# Altium project NRF_Layout_ver2.PrjPcb
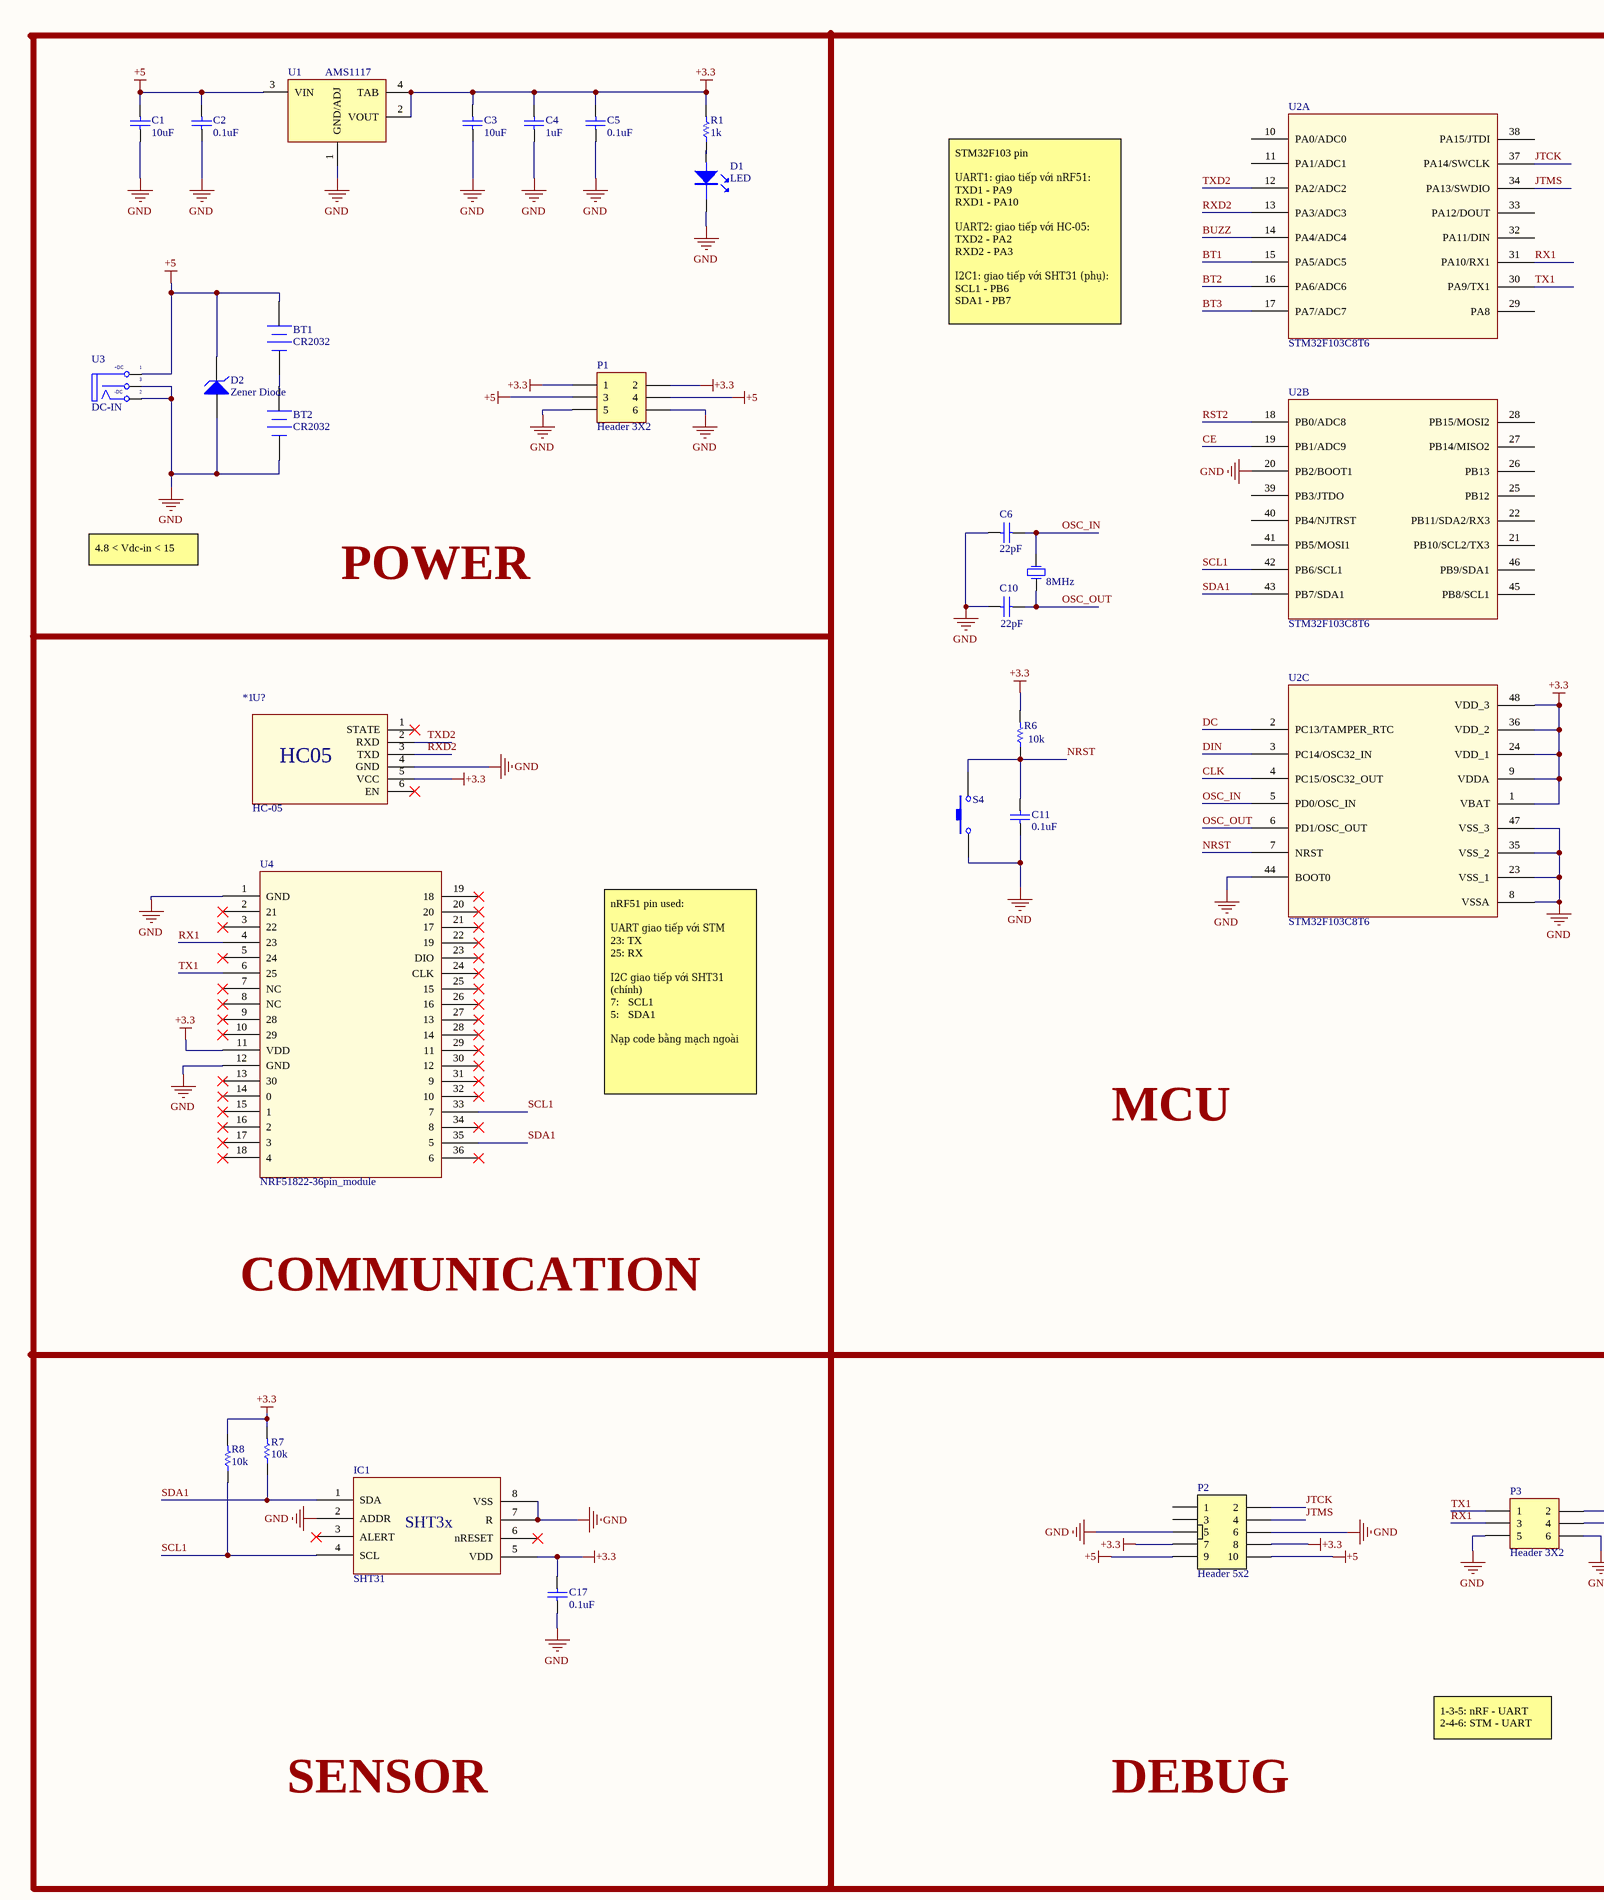
[diagram p0: Sheet1.SchDoc, left]
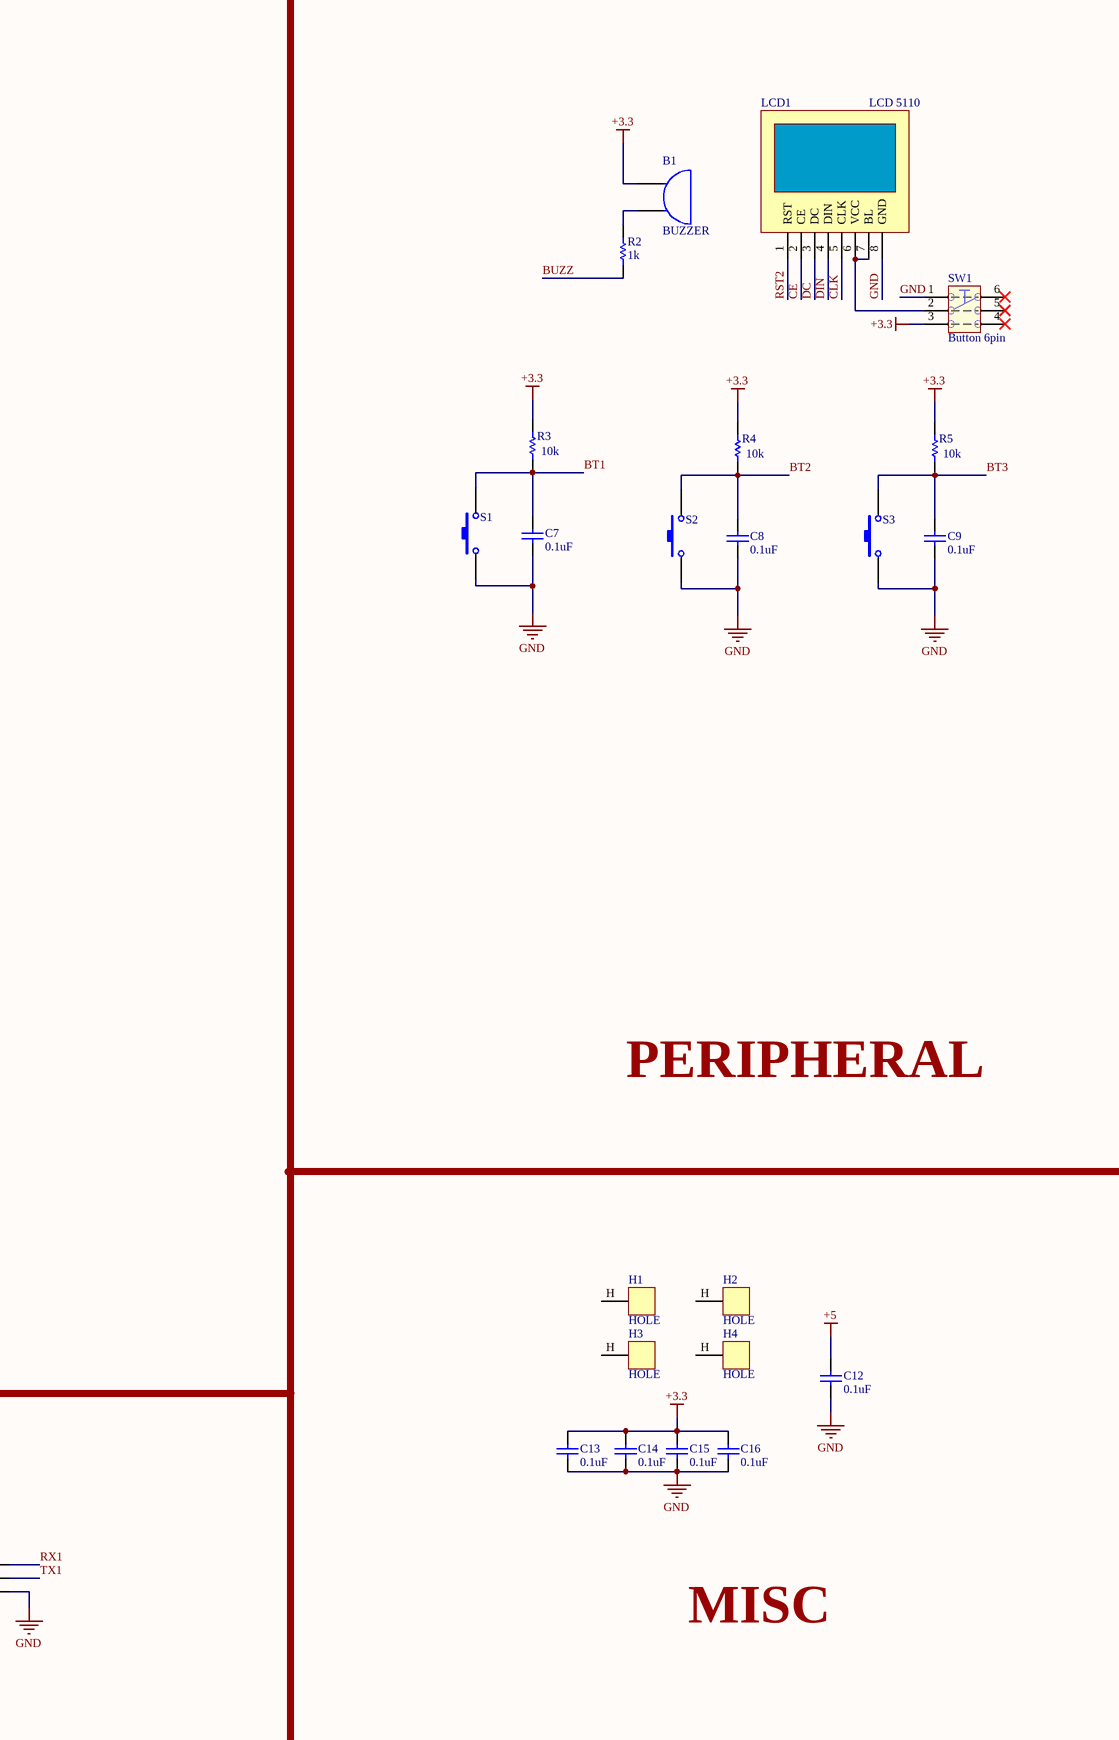
[diagram p1: Sheet1.SchDoc, right]
1 sheet, 50 parts. Net scope: global (net labels, ports and power ports of the same name join across sheets).
Board file: PCB1.PcbDoc

## Sheet Sheet1.SchDoc
size A2

### Parts
*1  HC-05  [HC-05]
B1  BUZZER  [SPEAKER]
BT1  CR2032  [PIN3V]
BT2  CR2032  [PIN3V]
C1  10uF  [C0805]
C2  0.1uF  [C0805]
C3  10uF  [C0805]
C4  1uF  [C0805]
C5  0.1uF  [C0805]
C6  22pF  [C0805]
C7  0.1uF  [C0805]
C8  0.1uF  [C0805]
C9  0.1uF  [C0805]
C10  22pF  [C0805]
C11  0.1uF  [C0805]
C12  0.1uF  [C0805]
C13  0.1uF  [C0805]
C14  0.1uF  [C0805]
C15  0.1uF  [C0805]
C16  0.1uF  [C0805]
C17  0.1uF  [C0805]
D1  LED  [LED SMD 0805]
D2  Zener Diode  [Zener Diode]
H1  HOLE  [HOLE]
H2  HOLE  [HOLE]
H3  HOLE  [HOLE]
H4  HOLE  [HOLE]
IC1  SHT31  [DFN-8]
LCD1  LCD 5110  [LCD 5110]
P1  Header 3X2  [HDR2X3]
P2  Header 5x2  [Header 5x2 horizontal (2.54mm)]
P3  Header 3X2  [HDR2X3]
R1  1k  [R0805]
R2  1k  [R0805]
R3  10k  [R0805]
R4  10k  [R0805]
R5  10k  [R0805]
R6  10k  [R0805]
R7  10k  [R0805]
R8  10k  [R0805]
S1  SWITCH  [SW 4PIN]  (value not drawn)
S2  SWITCH  [SW 4PIN]  (value not drawn)
S3  SWITCH  [SW 4PIN]  (value not drawn)
S4  SWITCH  [SW 4PIN]  (value not drawn)
SW1  Button 6pin  [BT 6pin]
U1  AMS1117  [SOT223 - 3 LEAD]
U2  STM32F103C8T6  [LQFP48_7x7]  (parts A,B,C of 3)
U3  DC-IN  [DC-IN]
U4  NRF51822-36pin_module  [NRF51822_Module]
Y1  8MHz  [XTAL_HC-49/U]

### Nets
+3.3: *1.5(VCC) B1.1(A) C3.2 C4.1 C5.2 C13.2 C14.2 C15.2 C16.2 C17.2 IC1.5(VDD) P1.1 P1.2 P2.7 P2.8 R1.1 R3.1 R4.1 R5.1 R6.1 R7.1 R8.1 SW1.3 U1.2(VOUT) U1.4(TAB) U2.1(VBAT) U2.9(VDDA) U2.24(VDD_1) U2.36(VDD_2) U2.48(VDD_3) U4.11(VDD)
+5: BT1.1(+) C1.2 C2.2 C12.2 D2.2(K) P1.3 P1.4 P2.9 P2.10 U1.3(VIN) U3.1(T)
GND: *1.4(GND) BT2.2(-) C1.1 C2.1 C3.1 C4.2 C5.1 C6.1 C7.1 C8.1 C9.1 C10.1 C11.1 C12.1 C13.1 C14.1 C15.1 C16.1 C17.1 D1.2 D2.1(A) IC1.2(ADDR) IC1.7(R) IC1.8(VSS) LCD1.8(GND) P1.5 P1.6 P2.5 P2.6 P3.5 P3.6 S1.1 S2.1 S3.1 S4.1 SW1.1 U1.1(GND/ADJ) U2.8(VSSA) U2.20(PB2/BOOT1) U2.23(VSS_1) U2.35(VSS_2) U2.44(BOOT0) U2.47(VSS_3) U3.2(TN) U3.3(S) U4.1(GND) U4.12(GND)
BT1: C7.2 R3.2 S1.2 U2.15(PA5/ADC5)
BT2: C8.2 R4.2 S2.2 U2.16(PA6/ADC6)
BT3: C9.2 R5.2 S3.2 U2.17(PA7/ADC7)
BUZZ: R2.2 U2.14(PA4/ADC4)
CE: LCD1.2(CE) U2.19(PB1/ADC9)
CLK: LCD1.5(CLK) U2.4(PC15/OSC32_OUT)
DC: LCD1.3(DC) U2.2(PC13/TAMPER_RTC)
DIN: LCD1.4(DIN) U2.3(PC14/OSC32_IN)
JTCK: P2.2 U2.37(PA14/SWCLK)
JTMS: P2.4 U2.34(PA13/SWDIO)
NRST: C11.2 R6.2 S4.2 U2.7(NRST)
OSC_IN: C6.2 U2.5(PD0/OSC_IN) Y1.2(OSC2)
OSC_OUT: C10.2 U2.6(PD1/OSC_OUT) Y1.1(OSC1)
RST2: LCD1.1(RST) U2.18(PB0/ADC8)
RX1: P3.2 P3.3 U2.31(PA10/RX1) U4.4(23)
RXD2: *1.3(TXD) U2.13(PA3/ADC3)
SCL1: IC1.4(SCL) R8.2 U2.42(PB6/SCL1) U4.33(7)
SDA1: IC1.1(SDA) R7.2 U2.43(PB7/SDA1) U4.35(5)
TX1: P3.1 P3.4 U2.30(PA9/TX1) U4.6(25)
TXD2: *1.2(RXD) U2.12(PA2/ADC2)
NetB1_2: B1.2(B) R2.1
NetBT1_2: BT1.2(-) BT2.1(+)
NetD1_1: D1.1 R1.2
NetLCD1_6: LCD1.6(VCC) LCD1.7(BL) SW1.2

Not connected (* = marked no-connect by the designer): *1 1(STATE)* 6(EN)*; H1 H(HOLE); H2 H(HOLE); H3 H(HOLE); H4 H(HOLE); IC1 3(ALERT)* 6(nRESET)*; P2 1 3; SW1 4(3)* 5(2)* 6(1)*; U2 10(PA0/ADC0) 11(PA1/ADC1) 21(PB10/SCL2/TX3) 22(PB11/SDA2/RX3) 25(PB12) 26(PB13) 27(PB14/MISO2) 28(PB15/MOSI2) 29(PA8) 32(PA11/DIN) 33(PA12/DOUT) 38(PA15/JTDI) 39(PB3/JTDO) 40(PB4/NJTRST) 41(PB5/MOSI1) 45(PB8/SCL1) 46(PB9/SDA1); U4 2(21)* 3(22)* 5(24)* 7(NC)* 8(NC)* 9(28)* 10(29)* 13(30)* 14(0)* 15(1)* 16(2)* 17(3)* 18(4)* 19(18)* 20* 21(17)* 22(19)* 23(DIO)* 24(CLK)* 25(15)* 26(16)* 27(13)* 28(14)* 29(11)* 30(12)* 31(9)* 32(10)* 34(8)* 36(6)*

### Notes on the sheet
- STM32F103 pin
  UART1: giao tiếp với nRF51:
  TXD1 - PA9
  RXD1 - PA10
  UART2: giao tiếp với HC-05:
  TXD2 - PA2
  RXD2 - PA3
  I2C1: giao tiếp với SHT31 (phụ):
  SCL1 - PB6
  SDA1 - PB7
- 4.8 < Vdc-in < 15
- POWER
- nRF51 pin used:
  UART giao tiếp với STM
  23: TX
  25: RX
  I2C giao tiếp với SHT31 (chính)
  7:   SCL1
  5:   SDA1
  Nạp code bằng mạch ngoài
- PERIPHERAL
- MCU
- COMMUNICATION
- MISC
- 1-3-5: nRF - UART
  2-4-6: STM - UART
- SENSOR
- DEBUG
- (in symbol HC-05) U?; HC05
- (in symbol JACK-DC) +DC; -DC
- (in symbol SHT31) SHT3x

### Library data of the parts
BT1 BT2 = Battery: Multicell Battery; Published: 24-Mar-1999; LatestRevisionDate: 17-Jul-2002; LatestRevisionNote: Re-released for DXP Platform.; PackageReference: BAT-2; Publisher: Altium Limited
C1 C3 = EMK212BB7106MG-T: CAP CER 10UF 16V X7R 0805; Manufacture: Taiyo Yuden; Link sale: #https://www.digikey.com/product-detail/en/taiyo-yuden/EMK212BB7106MG-T/587-3319-1-ND/4157364#; Pricing (USD): 0.57; Tolerance: ±20%; Partnumber: EMK212BB7106MG-T; Datasheet: #http://www.yuden.co.jp/productdata/catalog/mlcc06_e.pdf#; Value: 10uF; Creator: Quyen.nv; Category: Capacitor; Mounting type: Surface Mount; Supplier: Digikey; Operating Temperature: -55°C ~ 125°C; Voltage Rated: 16V; Temperature Coefficient: X7R; Detailed Value: 10UF 16V X7R
C2 C5 C7-C9 C11-C17 = C0805C104K4RACTU: CAP CER 0.1UF 16V X7R 0805; Manufacture: KEMET; Link sale: #https://www.digikey.com/product-detail/en/kemet/C0805C104K4RACTU/399-1167-1-ND/411442#; Pricing (USD): 0.22; Tolerance: ±10%; Detailed Value: 0.1uF-16V; Partnumber: C0805C104K4RACTU; Datasheet: #https://api.kemet.com/component-edge/download/datasheet/C0805C104K4RACTU.pdf#; Value: 0.1uF; Creator: Tunn; Category: Capacitor; Mounting type: Surface Mount; Supplier: Digikey; Operating Temperature: -55° to 125°C; Voltage Rated: 16V; Temperature Coefficient: X7R
C4 = GMK212B7105KG-T: CAP CER 1UF 35V X7R 0805; Manufacture: Taiyo Yuden; Link sale: #https://www.digikey.com/product-detail/en/taiyo-yuden/GMK212B7105KG-T/587-1438-1-ND/1004069#; Pricing (USD): 0.31; Tolerance: ±10%; Partnumber: GMK212B7105KG-T; Datasheet: #http://www.yuden.co.jp/productdata/catalog/mlcc06_e.pdf#; Value: 1uF; Creator: Quyen.nv; Category: Capacitor; Mounting type: Surface Mount; Supplier: Digikey; Operating Temperature: 35V; Voltage Rated: 35V; Temperature Coefficient: X7R; Detailed Value: 1UF 35V X7R
C6 C10 = C0805C224K3RACAUTO: CAP CER 0.22pF 0805; Manufacture: KEMET; Value: 0.22uF; Link sale: #https://www.digikey.com/product-detail/en/kemet/C0805C224K3RACAUTO/399-6947-1-ND/3314455#; Tolerance: ±10%; Voltage Rated: 25; Temperature Coefficient: X7R; Detailed Value: 0.22uF-25V-0805; Partnumber: C0805C224K3RACAUTO; Creator: Quyen.nv; Category: Capacitor; Mounting type: Surface Mount; Supplier: Digikey; Operating Temperature: -55°C ~ 125°C
D2 = Zener Diode: General SCH for Zener Diode
IC1 = SHT31: Sensirion Humidity & Temperature Sensor
P1 P3 = Header 3X2: Header, 3-Pin, Dual row; LatestRevisionDate: 17-Jul-2002; LatestRevisionNote: Re-released for DXP Platform.; Publisher: Altium Limited
P2 = Header 5x2 (2.54mm): Header 5x2 ,used for ST-Link
R1-R8 = RC0805FR-07100RL: RES SMD 100 OHM 1% 1/8W 0805; Manufacture: Yageo; Value: 100R; Link sale: #https://www.digikey.com/product-detail/en/yageo/RC0805FR-07100RL/311-100CRCT-ND/730490#; Pricing (USD): 0.1; Temperature Coefficient: ±100ppm/°C; Detailed Value: 100R 1% 1/8W; Partnumber: RC0805FR-07100RL; Creator: Quyen.nv; Category: Resistor; Mounting type: Surface Mount; Supplier: Digikey; Operating Temperature: -55°C ~ 155°C; Tolerance: 1%
SW1 = Button 6-pin 2-state: General Pin 2, unpush 2-1 - push 2-3
U2 = STM32F103C8T6-Multi-part: STM32F103C8T6-LQFP48
U3 = JACK-DC: Provide DC Voltage
U4 = NRF51822-Mudule
Y1 = XTAL: Crystal Oscillator; Published: 8-Jun-2000; LatestRevisionDate: 17-Jul-2002; LatestRevisionNote: Re-released for DXP Platform.; PackageReference: R38; Publisher: Altium Limited
S1-S4 = SWITCH: Published: 24-Mar-1999; LatestRevisionDate: 17-Jul-2002; LatestRevisionNote: Re-released for DXP Platform.; PackageReference: SPST-2; Publisher: Altium Limited